# Altium schematic sheet PowerCircuitry.SchDoc
size 431 x 190 mm; SheetNumber: 2; SheetTotal: 11
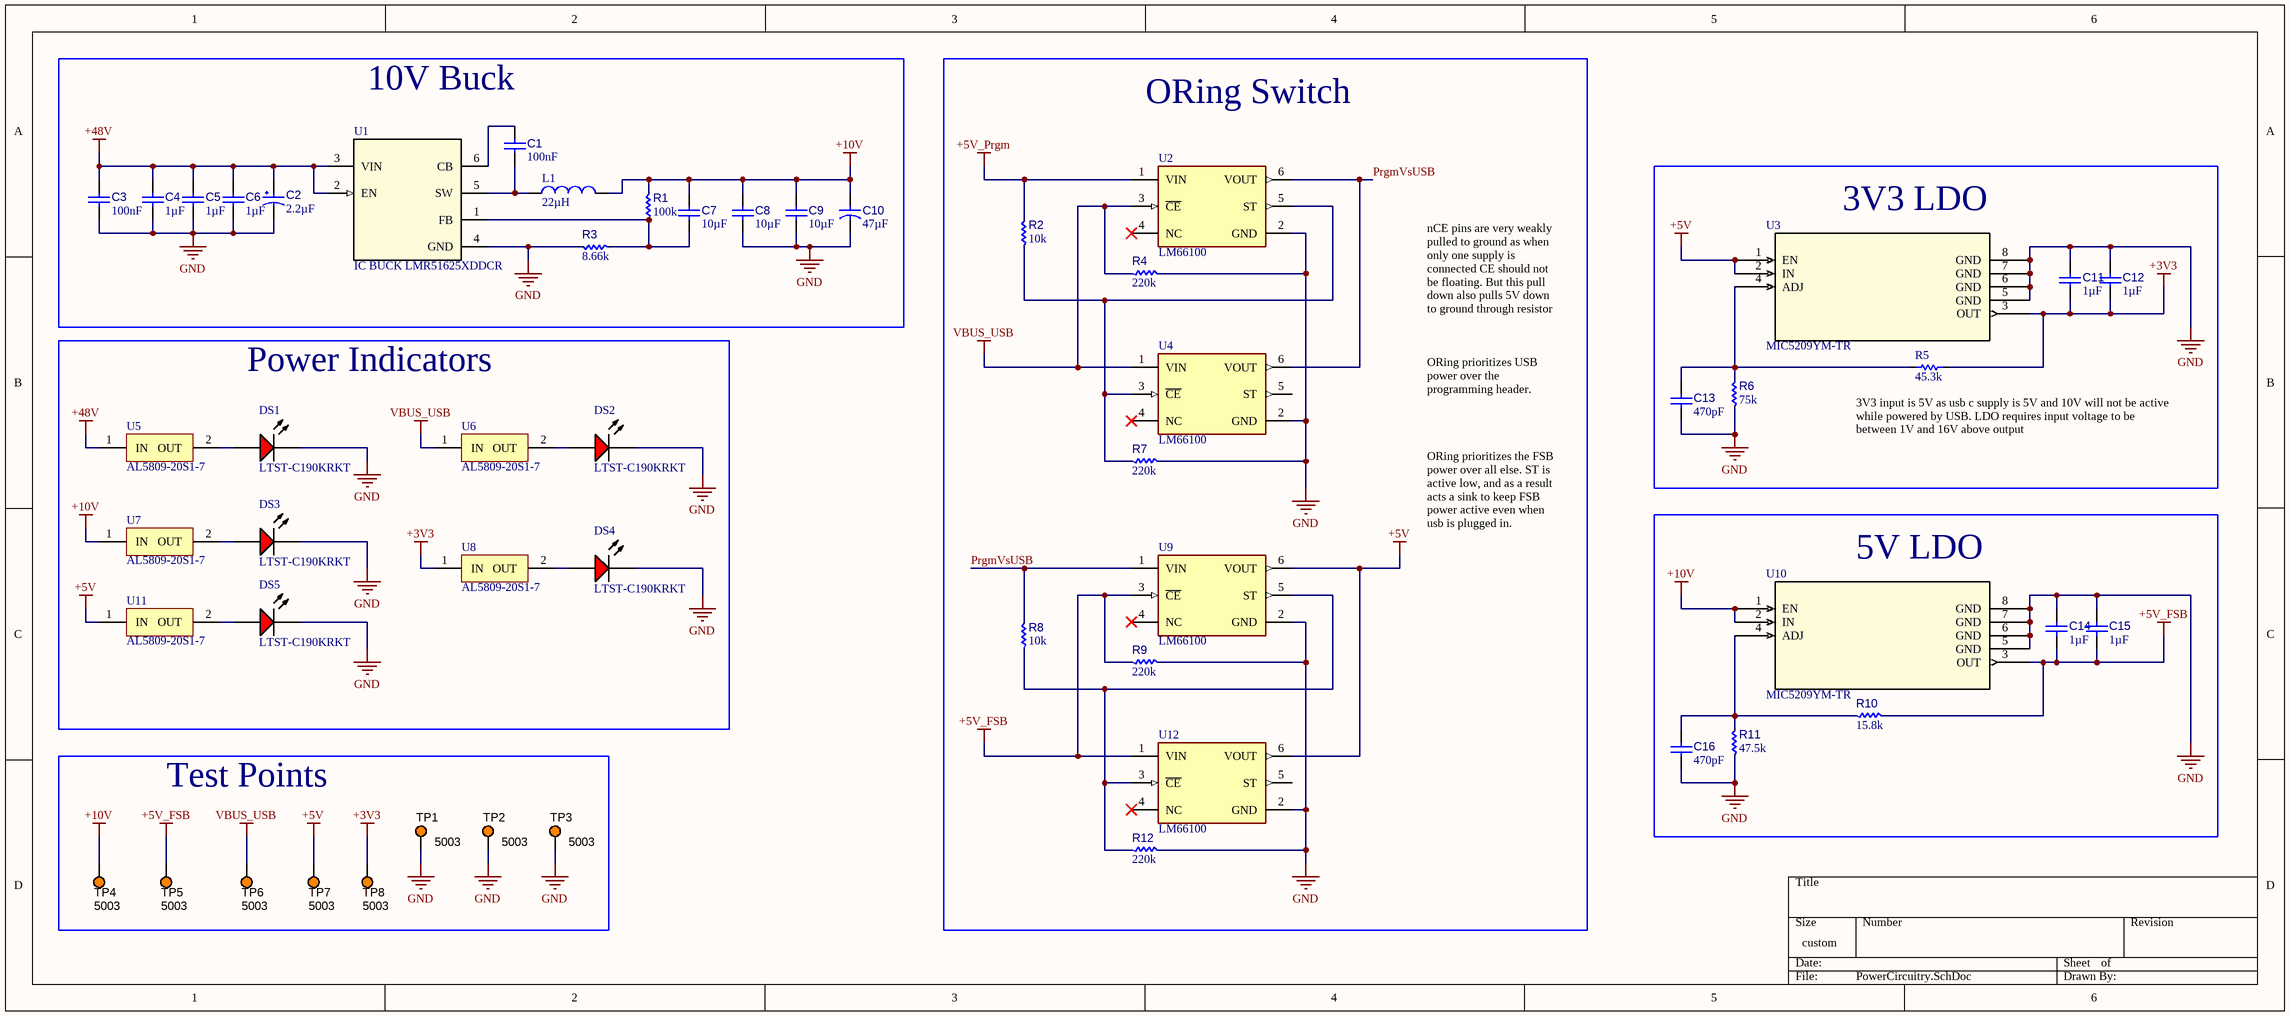
[diagram p0: PowerCircuitry.SchDoc]

## Parts
C1  value 100nF  [CAPC0402(1005)60_L]  (hidden comment: Capacitor 100nF +/-20% 50V 0402)
C2  value 2.2µF  [CAPPR55-200-1100X500X1200]  (hidden comment: CAP ELC 2.2uF 50V 20%)
C3  value 100nF  [CL32B475KCVZW6E-Footprint-1]  (hidden comment: CAP CER 100nF 100V 10% 1210)
C4  value 1µF  [CAP_0603_LD]  (hidden comment: CAP CER  1uF 50V X5R 0603)
C5  value 1µF  [CAP_0603_LD]  (hidden comment: CAP CER  1uF 50V X5R 0603)
C6  value 1µF  [CAP_0603_LD]  (hidden comment: CAP CER  1uF 50V X5R 0603)
C7  value 10µF  [CAPC0805(2012)145_L]  (hidden comment: Capacitor 10µF +/-20% 25V 0805)
C8  value 10µF  [CAPC0805(2012)145_L]  (hidden comment: Capacitor 10µF +/-20% 25V 0805)
C9  value 10µF  [CAPC0805(2012)145_L]  (hidden comment: Capacitor 10µF +/-20% 25V 0805)
C10  value 47µF  [FP-OS-CON-SMT-C6-MFG]  (hidden comment: CAP ELC 47uF 25V 20% 2626)
C11  value 1µF  [CAPC2013X145X50ML20T25]  (hidden comment: Capacitor 1 uF +/- 10% 25 V 0805)
C12  value 1µF  [CAPC2013X145X50ML20T25]  (hidden comment: Capacitor 1 uF +/- 10% 25 V 0805)
C13  value 470pF  [Copy of 0603]  (hidden comment: CAP 470pF FILM 16V 0603)
C14  value 1µF  [CAPC2013X145X50ML20T25]  (hidden comment: Capacitor 1 uF +/- 10% 25 V 0805)
C15  value 1µF  [CAPC2013X145X50ML20T25]  (hidden comment: Capacitor 1 uF +/- 10% 25 V 0805)
C16  value 470pF  [Copy of 0603]  (hidden comment: CAP 470pF FILM 16V 0603)
DS1  LTST-C190KRKT  [LTST-C191KRKT_V]
DS2  LTST-C190KRKT  [LTST-C191KRKT_V]
DS3  LTST-C190KRKT  [LTST-C191KRKT_V]
DS4  LTST-C190KRKT  [LTST-C191KRKT_V]
DS5  LTST-C190KRKT  [LTST-C191KRKT_V]
L1  value 22µH  [IND WIR 22uH 3.5A 20%-Footprint-1]  (hidden comment: IND WIR 22uH 3.5A 20%)
R1  value 100k  [RESC2013X70X40ML20T20]  (hidden comment: Resistor 100k +/-1% 0805 125 mW)
R2  value 10k  [RESC1005X40X25ML05T05]  (hidden comment: Resistor 10k +/-1% 0402 100 mW)
R3  value 8.66k  [RES 8.66K OHM 1% 1_8W 0805-Footprint-1]  (hidden comment: RES 8.66K OHM 1% 1/8W 0805)
R4  value 220k  [FP-CRGCQ0603-IPC_A]  (hidden comment: RMCF0603FT220K)
R5  value 45.3k  [0603]  (hidden comment: RES 43.5kR 0.15W 0.1% 0603)
R6  value 75k  [RES 75k 1% 0.1W 0603-Footprint-1]  (hidden comment: RES 75k 1% 0.1W 0603)
R7  value 220k  [FP-CRGCQ0603-IPC_A]  (hidden comment: RMCF0603FT220K)
R8  value 10k  [RESC1005X40X25ML05T05]  (hidden comment: Resistor 10k +/-1% 0402 100 mW)
R9  value 220k  [FP-CRGCQ0603-IPC_A]  (hidden comment: RMCF0603FT220K)
R10  value 15.8k  [RES 15.8k 1% 0.1W 0603-Footprint-1]  (hidden comment: RES 15.8k 1% 0.1W 0603)
R11  value 47.5k  [RES 47.5k 1% 0.1W 0603-Footprint-1]  (hidden comment: RES 47.5k 1% 0.1W 0603)
R12  value 220k  [FP-CRGCQ0603-IPC_A]  (hidden comment: RMCF0603FT220K)
TP1  5003  [KSTN-5003]
TP2  5003  [KSTN-5003]
TP3  5003  [KSTN-5003]
TP4  5003  [KSTN-5003]
TP5  5003  [KSTN-5003]
TP6  5003  [KSTN-5003]
TP7  5003  [KSTN-5003]
TP8  5003  [KSTN-5003]
U1  IC BUCK LMR51625XDDCR  [IC BUCK LMR51625XDDCR-Footprint-1]
U2  LM66100  [FP-DCK0006A-MFG]
U3  MIC5209YM-TR  [MIC5209YM-TR-Footprint-1]
U4  LM66100  [FP-DCK0006A-MFG]
U5  AL5809-20S1-7  [DIOD-SOD123-A_V]
U6  AL5809-20S1-7  [DIOD-SOD123-A_V]
U7  AL5809-20S1-7  [DIOD-SOD123-A_V]
U8  AL5809-20S1-7  [DIOD-SOD123-A_V]
U9  LM66100  [FP-DCK0006A-MFG]
U10  MIC5209YM-TR  [MIC5209YM-TR-Footprint-1]
U11  AL5809-20S1-7  [DIOD-SOD123-A_V]
U12  LM66100  [FP-DCK0006A-MFG]

## Blocks framed on the sheet
10V Buck: C1-C10 L1 R1 R3 U1
ORing Switch: R2 R4 R7-R9 R12 U2 U4 U9 U12
3V3 LDO: C11-C13 R5 R6 U3
Power Indicators: DS1-DS5 U5-U8 U11
5V LDO: C14-C16 R10 R11 U10
Test Points: TP1-TP8

## Nets
+3V3: C11.1 C12.1 R5.2 TP8.1 U3.3(OUT) U8.1(IN)
+5V: TP7.1 U3.1(EN) U3.2(IN) U9.6(VOUT) U11.1(IN) U12.6(VOUT)
+5V_FSB: C14.1 C15.1 R9.1 R10.2 TP5.1 U9.3(~{CE}) U10.3(OUT) U12.1(VIN)
+5V_Prgm: R2.2 U2.1(VIN)
+10V: C7.2 C8.2 C9.2 C10.2 L1.2 R1.2 TP4.1 U7.1(IN) U10.1(EN) U10.2(IN)
+48V: C2.1 C3.2 C4.2 C5.2 C6.2 U1.2(EN) U1.3(VIN) U5.1(IN)
GND: C2.2 C3.1 C4.1 C5.1 C6.1 C8.1 C9.1 C10.1 C11.2 C12.2 C13.1 C14.2 C15.2 C16.1 DS1.2(K) DS2.2(K) DS3.2(K) DS4.2(K) DS5.2(K) R3.2 R4.2 R6.1 R7.2 R9.2 R11.1 R12.2 TP1.1 TP2.1 TP3.1 U1.4(GND) U2.2(GND) U3.5(GND) U3.6(GND) U3.7(GND) U3.8(GND) U4.2(GND) U9.2(GND) U10.5(GND) U10.6(GND) U10.7(GND) U10.8(GND) U12.2(GND)
VBUS_USB: R4.1 TP6.1 U2.3(~{CE}) U4.1(VIN) U6.1(IN)
PrgmVsUSB: R8.2 U2.6(VOUT) U4.6(VOUT) U9.1(VIN)
NetC1_1: C1.1 L1.1 U1.5(SW)
NetC1_2: C1.2 U1.6(CB)
NetC7_1: C7.1 R1.1 R3.1 U1.1(FB)
NetC13_2: C13.2 R5.1 R6.2 U3.4(ADJ)
NetC16_2: C16.2 R10.1 R11.2 U10.4(ADJ)
NetDS1_1: DS1.1(A) U5.2(OUT)
NetDS2_1: DS2.1(A) U6.2(OUT)
NetDS3_1: DS3.1(A) U7.2(OUT)
NetDS4_1: DS4.1(A) U8.2(OUT)
NetDS5_1: DS5.1(A) U11.2(OUT)
NetR2_1: R2.1 R7.1 U2.5(ST) U4.3(~{CE})
NetR8_1: R8.1 R12.1 U9.5(ST) U12.3(~{CE})

Not connected (* = marked no-connect by the designer): U2 4(NC)*; U4 4(NC)* 5(ST); U9 4(NC)*; U12 4(NC)* 5(ST)

## Notes on the sheet
- nCE pins are very weakly pulled to ground as when only one supply is connected CE should not be floating. But this pull down also pulls 5V down to ground through resistor
- ORing prioritizes USB power over the programming header.
- (near R5) 3V3 input is 5V as usb c supply is 5V and 10V will not be active while powered by USB. LDO requires input voltage to be between 1V and 16V above output
- ORing prioritizes the FSB power over all else. ST is active low, and as a result acts a sink to keep FSB power active even when usb is plugged in.

## Library data of the parts
C1 = CMP-001-00067-4: Chip Capacitor, 100nF +/-20%, 50V, 0402, Thickness 0.6 mm; Tolerance: 10%; Voltage Rating: 50V; Min Operating Temperature: -55°C; Mounting Technology: SMT; Case/Package: 0402; Pins: 2; Max Operating Temperature: 85°C
C2 = CMP-001-00029-9: ECA1HM2R2 Aluminum Electrolytic Capacitor, 2.2 uF, +/- 20%, 50 V, -40 to 85 degC, 2-Pin THD, RoHS, Bulk; Manufacturer: Panasonic; Ripple Current (AC): 20mA; Mounting Technology: TH; Min Operating Temperature: -40°C; Packaging: Bulk; RoHS Compliant: True; Tolerance: 20%; Manufacturer URL: http://www.panasonic.com/; Pins: 2; Voltage Rating: 50V; Lead Pitch: 2mm; Case/Package: Radial; Datasheet URL: https://industrial.panasonic.com/cdbs/www-data/pdf/RDF0000/ABA0000C1218.pdf; Capacitor Type: Electrolytic; Diameter: 5mm; Datasheet Version: Rev. 05, 10/2016; Package Reference: CAPPR55-200-1100X500X1200; Max Operating Temperature: 85°C; Ripple Current: 20mA; Package Description: 2-Pin Radial Lead, Dia 5 mm, Height 12 mm; Package Quantity: 200
C3 = CMP-001-00197-2: C1210C104K1RACAUTO - Cap Ceramic 0.1uF 100V X7R 10% Pad SMD 1210 125C Automotive T/R; Tolerance: 10%; Mounting Technology: Surface Mount; Pins: 2; Case/Package: 1210; RoHS Compliant: Yes; Capacitor Type: Ceramic; Min Operating Temperature: -55°C; Max Operating Temperature: 125°C; Voltage Rating: 100V
C4-C6 = CMP-001-00122-1: CL10A105KB8NNNC - Ceramic Capacitor, Multilayer, Ceramic, 50V, 10% +Tol, 10% -Tol, X5R, 15% TC, 1uF, Surface Mount, 0603; Voltage: 16V; Multilayer: Yes; Dielectric: X7R; Material: Ceramic; Rated DC Voltage (URdc): 50V; Tolerance  (fill in as +-): 10%; Termination: Wraparound; Case/Package: 0603; Reach SVHC Compliant: Yes; Radiation Hardening: No; Height: 0.9mm; Terminal Finish: Nickel; Max Operating Temperature: 85°C; Length: 1.6mm; Dielectric Material: Ceramic; Case Code (Imperial): 0603; Packaging: Tape and Reel; Thickness: 0.035inch; Package Shape: Rectangular; Lead Free: Lead Free; Tolerance: 10%; Capacitor Type: Ceramic; Mounting Technology: Surface Mount; Width: 0.8mm; Case Code (Metric): 1608; RoHS Compliant: Yes; Series: CL; Min Operating Temperature: -55°C; Pins: 2; Package Style: SMTMeter; Tolerance (fill in as +-): 10%; JESD-609 Code: e3; Voltage Rating: 16V; Temperature Characteristics Code: X5R; Voltage Rating (DC): 16V; Depth: 0.8mm; Construction: Flat
C7-C9 = CMP-001-00079-5: Chip Capacitor, 10µF +/-20%, 25V, 0805, Thickness 1.45 mm; Tolerance: 10%; Voltage Rating: 25V; Pins: 2; Min Operating Temperature: -55°C; Case/Package: 0805; Max Operating Temperature: 85°C; Mounting Technology: SMT
C10 = CMP-001-00108-3: 25SVPF47M - Aluminum Electrolytic Capacitor, Polarized,  -Aluminum (wet), 25V, 20% +Tol, 20% -Tol, 47uF, Surface Mount, 2626; Ripple Current: 140mA; Capacitor Type: Aluminium; Pins: 2; Mounting Technology: Surface Mount; Min Operating Temperature: -55°C; RoHS Compliant: Yes; Case/Package: 2626; Max Operating Temperature: 105°C
C11 C12 C14 C15 = CMP-001-00010-7: Chip Capacitor, 1 uF, +/-10%, 25 V, 0805 (2012 Metric); Capacitor Type: Ceramic; Voltage Rating: 25V; Min Operating Temperature: -55°C; RoHS Compliant: True; Mounting Technology: SM; Pins: 2; Tolerance: 10%; Case/Package: 0805; Max Operating Temperature: 125°C
C13 C16 = CMP-001-00212-1: ECHU1C471GX5 Film Capacitor, Plastic, 16V, 2% +Tol, 2% -Tol, 0.00047uF, Surface Mount, 0603, ECHU1C471GX5; Tolerance: 2%; Voltage Rating: 16V; Case/Package: 0603; Mounting Technology: Surface Mount; Max Operating Temperature: 125°C; Min Operating Temperature: -55°C
DS1-DS5 = CMP-007-00024-2: LED Uni-Color Red, 62.5 mW, 25 mA, -30 to 85 degC, 2-Pin SMD, RoHS, Tape and Reel; Manufacturer: Lite-On; Power: 75mW; Forward Voltage: 2V; Luminous Intensity: 54mcd; Lens Style: Diffused; Viewing Angle: 130degrees; Forward Current: 20mA; Manufacturer URL: http://www.us.liteon.com/; Case/Package: 0603; Datasheet Version: Rev. F, 05/2013; Package Reference: C191KRKT; Datasheet URL: http://optoelectronics.liteon.com/upload/download/DS-22-99-0151/S_110_LTST-C190KRKT.pdf; Package Description: 2-Pin Surface Mount Device, Body 1.6 x 0.8 mm; Nominal Vf: 2V; Packaging: TapeandReel; RoHS Compliant: True; Pins: 2; Illumination Colour: Red; Colour: Red; Mounting Technology: SM; Package Quantity: 3000; Min Operating Temperature: -55°C; Max Operating Temperature: 85°C
L1 = CMP-006-00051-2: SRR1208-220ML Inductor Power Shielded Wirewound 22uH 20% 1KHz 23Q-Factor Ferrite 3.5A 0.043Ohm DCR T/R SRR1208-220ML; Self Resonant Frequency: 7MHz; Mounting Technology: Surface Mount; Tolerance: 20%; Pins: 2; Max Current Rating: 3.5A; Current Rating: 3.5A; Case/Package: 5050; Min Operating Temperature: -40°C; Max Operating Temperature: 125°C
R1 = CMP-009-00024-9: Chip Resistor, 100 KOhm, +/- 1%, 0.125 W, -55 to 155 degC, 0805 (2012 Metric); Power: 125mW; Voltage Rating: 150V; RoHS Compliant: True; Case/Package: 0805; Mounting Technology: SM; Min Operating Temperature: -55°C; Tolerance: 1%; Max Operating Temperature: 155°C; Pins: 2
R2 R8 = CMP-009-00015-9: Chip Resistor, 10 KOhm, +/- 1%, 0.1 W, -55 to 155 degC, 0402 (1005 Metric); Voltage Rating: 50V; Power: 100mW; Mounting Technology: SM; Case/Package: 0402; Max Operating Temperature: 155°C; Pins: 2; Tolerance: 1%; RoHS Compliant: True; Min Operating Temperature: -55°C
R3 = CMP-009-00374-1: RMCF0805FT8K66 Res Thick Film 0805 8.66K Ohm 1% 1/8W ±100ppm/°C Molded SMD SMD Paper T/R RMCF0805FT8K66; Voltage Rating: 150V; Mounting Technology: Surface Mount; Case/Package: 0805; Max Operating Temperature: 155°C; Tolerance: 1%; Min Operating Temperature: -55°C
R4 R7 R9 R12 = CMP-009-00360-1: Res Thick Film 0603 220K Ohm 1% 0.1W(1/10W) ±100ppm/C Pad SMD Automotive T/R; Voltage Rating: 75V; Max Operating Temperature: 155°C; Tolerance: 1%; Case/Package: 0603; Mounting Technology: Surface Mount; Min Operating Temperature: -55°C
R5 = CMP-009-00221-1: RQ73C1J45K3BTD - Fixed Resistor, Thin Film, 0.15W, 45300ohm, 75V, 0.1% +/-Tol, 10ppm/Cel, Surface Mount, 0603; Power: 150mW; Min Operating Temperature: -55°C; Mounting Technology: Surface Mount; Case/Package: 0603; RoHS Compliant: Yes; Voltage Rating: 75V; Max Operating Temperature: 155°C; Pins: 2; Tolerance: 0.1%
R6 = CMP-009-00241-2: Fixed Resistor, Metal Glaze/thick Film, 0.1W, 75000ohm, 75V, 1% +/-Tol, 100ppm/Cel, Surface Mount, 0603 RMCF0603FT75K0; Power: 100mW; Mounting Technology: Surface Mount; Max Operating Temperature: 155°C; Pins: 2; Case/Package: 0603; RoHS Compliant: Yes; Tolerance: 1%; Min Operating Temperature: -55°C
R10 = CMP-009-00239-3: Fixed Resistor, Metal Glaze/thick Film, 0.1W, 15800ohm, 75V, 1% +/-Tol, 100ppm/Cel, Surface Mount, 0603 RC0603FR-0715K8L; Power: 100mW; Max Operating Temperature: 155°C; Mounting Technology: Surface Mount; RoHS Compliant: Yes; Tolerance: 1%; Pins: 2; Min Operating Temperature: -55°C; Case/Package: 0603
R11 = CMP-009-00240-2: Fixed Resistor, Metal Glaze/thick Film, 0.1W, 47500ohm, 75V, 1% +/-Tol, 100ppm/Cel, Surface Mount, 0603 ERJ-3EKF4752V; Power: 100mW; Mounting Technology: Surface Mount; Min Operating Temperature: -55°C; Tolerance: 1%; Pins: 2; RoHS Compliant: Yes; Max Operating Temperature: 155°C; Case/Package: 0603
TP1-TP8 = CMP-002-00037-2: Test Point, Orange, Height 4.6 mm, Tail Length 3 mm, 1-Pin THD, RoHS; Manufacturer: Keystone; Colour: Orange; Packaging: Bulk; Package Description: 1-Pin Through Hole Device, Dia 2.54 mm; Pins: 1; Package Reference: 5003; Datasheet Version: Jun-15; Case/Package: 5003; Mounting Technology: TH; Connector Type: TestPoint; Diameter: 2.54mm; Contact Material: Bronze; Datasheet URL: http://keyelco.com/userAssets/file/M65p56.pdf; Manufacturer URL: http://www.keyelco.com/; Package Quantity: 10; Contact Plating: Tin; RoHS Compliant: True
U1 = CMP-019-00106-1: SIMPLE SWITCHER® synchronous buck converter with 4.3V-to-60V, 2.5A and low quiescent current 6-SOT-23-THIN -40 to 150; Pins: 6
U2 U4 U9 U12 = CMP-019-00086-1: 1.5-V to 5.5-V, 1.5-A, 0.5-µA IQ ideal diode with integrated FET 6-SC70 -40 to 105; Pins: 6
U3 U10 = MIC5209YM-TR-2: IC REG LIN POS ADJ 500MA 8SOIC
U5-U8 U11 = CMP-00024-00007-1: Led Driver, Cc/Linear, -40 To 125Deg C Rohs Compliant: Yes; Min Input Voltage: 2.5V; Max Output current: 21mA; Max Supply Voltage: 60V; Mounting Technology: Surface Mount; Max Operating Temperature: 125°C; Pins: 2; Min Operating Temperature: -40°C; Case/Package: SOD